# EAGLE design nunchuck_mod (EAGLE 7.7.0)
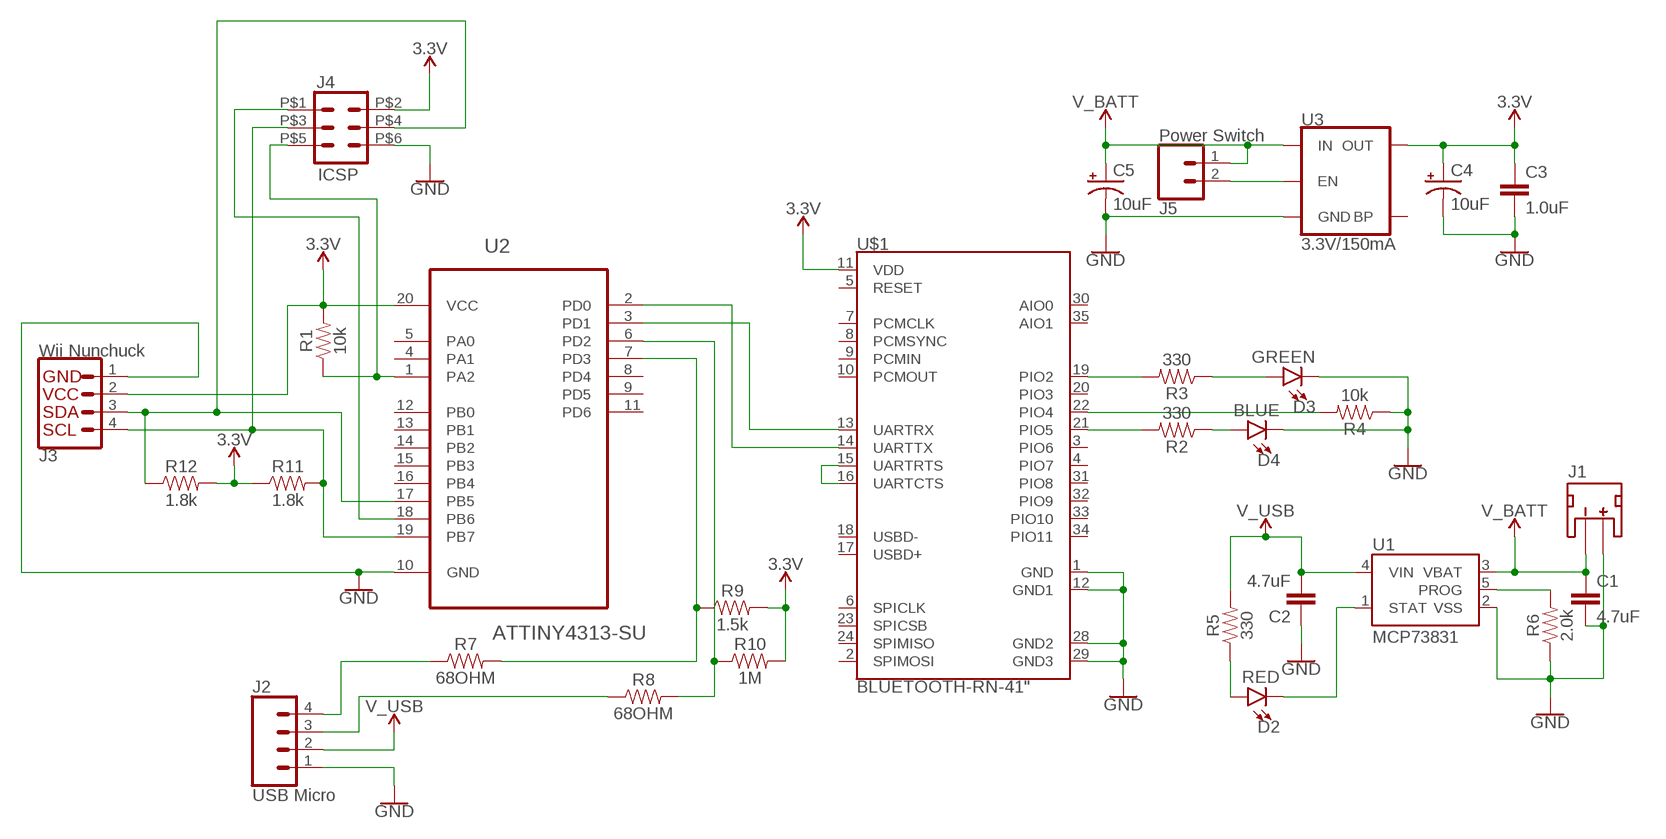
[diagram p0: schematic, sheet 1]

## Parts
C1  4.7uF  4.7UF0603  [0603]
C2  4.7uF  4.7UF0603  [0603]
C3  1.0uF  1.0UF-0603-16V-10%  [0603]
C4  10uF  10UF-POLAR-0603-6.3V-20%(TANT)  [0603-POLAR]
C5  10uF  10UF-POLAR-0603-6.3V-20%(TANT)  [0603-POLAR]
D2  RED  LED-RED0603  [LED-0603]
D3  GREEN  LED-GREEN0603  [LED-0603]
D4  BLUE  LED-BLUE0603  [LED-0603]
J1  JST_2MM_MALE  [JST-2-SMD]
J2  USB Micro  CONN_04  [1X04]
J3  Wii Nunchuck  I2C_STANDARD  [1X04]
J4  ICSP  CONN_03X2POGO_PINS  [2X3_POGO]
J5  Power Switch  CONN_02  [1X02]
R1  10k  10KOHM-0603-1/10W-1%  [0603]
R2  330  330OHM-0603-1/10W-1%  [0603]
R3  330  330OHM-0603-1/10W-1%  [0603]
R4  10k  10KOHM-0603-1/10W-1%  [0603]
R5  330  330OHM-0603-1/10W-1%  [0603]
R6  2.0k  2.0KOHM-0603-1/10W-5%  [0603]
R7  68OHM  68OHM-0603-1/10W-1%  [0603]
R8  68OHM  68OHM-0603-1/10W-1%  [0603]
R9  1.5k  1.5KOHM-0603-1/10W-1%  [0603]
R10  1M  1MOHM-0603-1/4W-5%  [0603]
R11  1.8k  1.8KOHM-0603-1/10W-1%  [0603]
R12  1.8k  1.8KOHM-0603-1/10W-1%  [0603]
U1  MCP73831  [SOT23-5]
U2  ATTINY4313-SU  [SOIC127P1032X265-20N]
U3  3.3V/150mA  V_REG_MIC52053.3V  [SOT23-5]
U$1  BLUETOOTH-RN-41"  [RN41]

## Nets
3.3V: C3.1 C4.+ J3.2 J4.P$2 R1.2 R9.2 R10.2 R11.1 R12.2 U2.20(VCC) U3.5(OUT) U$1.11(VDD)
GND: C1.2 C2.1 C3.2 C4.- C5.- D3.C D4.C J1.2(+) J2.1 J3.1 J4.P$6 R4.1 R6.1 U1.2(VSS) U2.10(GND) U3.2(GND) U$1.1(GND) U$1.12(GND1) U$1.28(GND2) U$1.29(GND3)
N$1: R3.2 U$1.19(PIO2)
N$2: R4.2 U$1.22(PIO4)
N$3: R2.2 U$1.21(PIO5)
N$4: D4.A R2.1
N$5: D3.A R3.1
N$6: U2.2(PD0) U$1.14(UARTTX)
N$7: U2.3(PD1) U$1.13(UARTRX)
N$8: U$1.15(UARTRTS) U$1.16(UARTCTS)
N$10: D2.A R5.1
N$11: R6.2 U1.5(PROG)
N$12: R8.2 R10.1 U2.6(PD2)
N$13: J5.2 U3.3(EN)
N$15: J3.4 J4.P$3 R11.2 U2.19(PB7)
N$16: D2.C U1.1(STAT)
N$18: R7.2 R9.1 U2.7(PD3)
N$19: J2.4 R7.1
N$20: J2.3 R8.1
N$21: J4.P$5 R1.1 U2.1(PA2)
N$22: J3.3 J4.P$4 R12.1 U2.17(PB5)
N$23: J4.P$1 U2.18(PB6)
V_BATT: C1.1 C5.+ J1.1(-) J5.1 U1.3(VBAT) U3.1(IN)
V_USB: C2.2 J2.2 R5.2 U1.4(VIN)
Unconnected: J1.NC1(PAD1) J1.NC2(PAD2) U2.4(PA1) U2.5(PA0) U2.8(PD4) U2.9(PD5) U2.11(PD6) U2.12(PB0) U2.13(PB1) U2.14(PB2) U2.15(PB3) U2.16(PB4) U3.4(BP) U$1.2(SPIMOSI) U$1.3(PIO6) U$1.4(PIO7) U$1.5(RESET) U$1.6(SPICLK) U$1.7(PCMCLK) U$1.8(PCMSYNC) U$1.9(PCMIN) U$1.10(PCMOUT) U$1.17(USBD+) U$1.18(USBD-) U$1.20(PIO3) U$1.23(SPICSB) U$1.24(SPIMISO) U$1.30(AIO0) U$1.31(PIO8) U$1.32(PIO9) U$1.33(PIO10) U$1.34(PIO11) U$1.35(AIO1)

## Library data of the parts
C1 C2 = SparkFun-Capacitors:4.7UF: 4.7µF ceramic capacitors A capacitor is a passive two-terminal electrical component used to store electrical energy temporarily in an electric field.; PROD_ID: CAP-08280
C3 = SparkFun-Capacitors:1.0UF: 1µF ceramic capacitors A capacitor is a passive two-terminal electrical component used to store electrical energy temporarily in an electric field.; PROD_ID: CAP-00868
C4 C5 = SparkFun-Capacitors:10UF-POLAR: 10.0µF polarized capacitors A capacitor is a passive two-terminal electrical component used to store electrical energy temporarily in an electric field.; PROD_ID: CAP-13210
D2 = SparkFun-LED:LED-RED: Red SMD LED Used in manufacturing of most products at SparkFun Packages: 0603 - SMD 0603 package [Product Link] <http://docs.avagotech.com/docs/AV02-0551EN> 0603 SMART - SMD 0603 SMART package ( more efficient and expensive)[Product Link] <http://www.osram-os.com/Graphics/XPic2/00077099_0.pdf> 1206 - SMD1206 package [Product Link] <https://www.sparkfun.com/datasheets/DevTools/LilyPad/Q150OVS4.pdff> SparkFun Products: Pro Mini 328 -5V <https://www.sparkfun.com/products/821> RedBoard <https://www.sparkfun.com/products/12757> IOIO-OTG <https://www.sparkfun.com/products/13613>; PROD_ID: DIO-00819
D3 = SparkFun-LED:LED-GREEN: Green SMD LED Used in manufacturing of various products at SparkFun Packages: 0603 - SMD 0603 package [Product Link] <http://www.futureelectronics.com/en/technologies/semiconductors/optoelectronics/leds/Pages/9894312-LTST-C190GKT.aspx?CrossPart=HSMG-C190&IM=0> LilyPad 1206 - SMD1206 LilyPad package [Product Link] <http://www.futureelectronics.com/en/Technologies/Product.aspx?ProductID=IN150NGHARVATEKCORPORATION2049943&IM=0> 1206 - SMD1206 package [Product Link] <http://www.futureelectronics.com/en/technologies/semiconductors/optoelectronics/leds/Pages/8315665-LTST-C150KGKT.aspx?IM=0> 1206 Bottom Mount -SMD 1206 Bottom Mount [Product Link] <http://www.digikey.com/product-detail/en/lite-on-inc/LTST-C230KGKT/160-1456-1-ND/386854> SparkFun Products: Pro Mini 328 -5V <https://www.sparkfun.com/products/821> RedBoard <https://www.sparkfun.com/products/12757> MP3 Trigger <https://www.sparkfun.com/products/13720> Makey Makey <https://www.sparkfun.com/products/11076>; PROD_ID: DIO-00821
D4 = SparkFun-LED:LED-BLUE: Blue SMD LED Used in manufacturing of various products at SparkFun Packages: 0603 - SMD 0603 package [Product Link] <http://www.digikey.com/product-detail/en/SMLE12BC7TT86/511-1589-2-ND/1641808> 1206 - SMD1206 package [Product Link] <http://www.digikey.com/product-detail/en/lite-on-inc/LTST-C150TBKT/160-1643-1-ND/573584> SparkFun Products: ESP8266 Thing-Dev Board <https://www.sparkfun.com/products/13711> RedBoard <https://www.sparkfun.com/products/12757>; PROD_ID: DIO-08575
J1 = SparkFun-Connectors:JST_2MM_MALE: JST 2MM MALE RA CONNECTOR Two pin, compact surface mount connector. Commonly used as a battery input connection point. We really like the solid locking feeling and high current rating on these small connectors. We use these all the time as battery connectors. Mates to single-cell LiPo batteries. Here is the connector we sell at SparkFun: JST Right Angle Connector - White <https://www.sparkfun.com/products/8612> (PRT-08612) Datasheet <http://www.sparkfun.com/datasheets/Prototyping/Connectors/JST-Horizontal.pdf> It was used on these SparkFun products: SparkFun MOSFET Power Controller <https://www.sparkfun.com/products/11214> (PRT-11214) SparkFun Battery Babysitter - LiPo Battery Manager <https://www.sparkfun.com/products/13777> (PRT-13777) And many, many others that required a lipo battery connection.; PROD_ID: CONN-11443; SF_ID: PRT-08612
J2 = SparkFun-Connectors:CONN_04: Multi connection point. Often used as Generic Header-pin footprint for 0.1 inch spaced/style header connections On any of the 0.1 inch spaced packages, you can populate with these: Break Away Headers - Straight <https://www.sparkfun.com/products/116> (PRT-00116) Break Away Male Headers - Right Angle <https://www.sparkfun.com/products/553> (PRT-00553) Female Headers <https://www.sparkfun.com/products/115> (PRT-00115) Break Away Headers - Machine Pin <https://www.sparkfun.com/products/117> (PRT-00117) Break Away Female Headers - Swiss Machine Pin <https://www.sparkfun.com/products/743> (PRT-00743) For SCREWTERMINALS and SPRING TERMINALS visit here: Screw Terimnals on SparkFun.com <https://www.sparkfun.com/search/results?term=Screw+Terminals> (5mm/3.5mm/2.54mm spacing) This device is also useful as a general connection point to wire up your design to another part of your project. Our various solder wires solder well into these plated through hole pads. Hook-Up Wire - Assortment (Stranded, 22 AWG) <https://www.sparkfun.com/products/11375> (PRT-11375) Hook-Up Wire - Assortment (Solid Core, 22 AWG) <https://www.sparkfun.com/products/11367> (PRT-11367) View the entire wire category on our website here <https://www.sparkfun.com/categories/141> Special notes: Molex polarized connector foot print use with SKU : PRT-08231 with associated crimp pins and housings. 1MM SMD Version SKU: PRT-10208; PROD_ID: CONN-09696
J3 = SparkFun-Connectors:I2C_STANDARD: SparkFun I2C Standard Pinout Header SparkFun has standardized on a pinout for all I2C based sensor breakouts. This pinout allows I2C boards to be plugged directly into the headers on Arduino Uno compatible boards, and to be daisy chained easily. Example SparkFun Products: SparkFun Atmospheric Sensor Breakout - BME280 <https://www.sparkfun.com/products/13676> SparkFun Altitude/Pressure Sensor Breakout - MPL3115A2 <https://www.sparkfun.com/products/11084> SparkFun TOF Range Finder Sensor - VL6180 <https://www.sparkfun.com/products/12785>
J4 = SparkFun-Connectors:CONN_03X2: Multi connection point. Often used as Generic Header-pin footprint for 0.1 inch spaced/style header connections You can populate with any combo of single row headers, but if you'd like an exact match, check these: Header - 2x3 (Male, 0.1") <https://www.sparkfun.com/products/12807> (PRT-12807) Header - 2x3 (Female, 0.1") <https://www.sparkfun.com/products/13010> (PRT-13010) 2x3 Pin Shrouded Header <https://www.sparkfun.com/products/10877> (PRT-10877) On any of the 0.1 inch spaced packages, you can populate with these: Break Away Headers - Straight <https://www.sparkfun.com/products/116> (PRT-00116) Break Away Male Headers - Right Angle <https://www.sparkfun.com/products/553> (PRT-00553) Female Headers <https://www.sparkfun.com/products/115> (PRT-00115) Break Away Headers - Machine Pin <https://www.sparkfun.com/products/117> (PRT-00117) Break Away Female Headers - Swiss Machine Pin <https://www.sparkfun.com/products/743> (PRT-00743) Special note: the shrouded connector mates well with our 3x2 ribbon cables: Ribbon Crimp Connector - 6-pin (2x3, Female) <https://www.sparkfun.com/products/10651> (PRT-10651) Ribbon Cable - 6 wire (15ft) <https://www.sparkfun.com/products/10646> (PRT-10646); PROD_ID: HW-11044
J5 = SparkFun-Connectors:CONN_02: Multi connection point. Often used as Generic Header-pin footprint for 0.1 inch spaced/style header connections On any of the 0.1 inch spaced packages, you can populate with these: Break Away Headers - Straight <https://www.sparkfun.com/products/116> (PRT-00116) Break Away Male Headers - Right Angle <https://www.sparkfun.com/products/553> (PRT-00553) Female Headers <https://www.sparkfun.com/products/115> (PRT-00115) Break Away Headers - Machine Pin <https://www.sparkfun.com/products/117> (PRT-00117) Break Away Female Headers - Swiss Machine Pin <https://www.sparkfun.com/products/743> (PRT-00743) For SCREWTERMINALS and SPRING TERMINALS visit here: Screw Terimnals on SparkFun.com <https://www.sparkfun.com/search/results?term=Screw+Terminals> (5mm/3.5mm/2.54mm spacing) This device is also useful as a general connection point to wire up your design to another part of your project. Our various solder wires solder well into these plated through hole pads. Hook-Up Wire - Assortment (Stranded, 22 AWG) <https://www.sparkfun.com/products/11375> (PRT-11375) Hook-Up Wire - Assortment (Solid Core, 22 AWG) <https://www.sparkfun.com/products/11367> (PRT-11367) View the entire wire category on our website here <https://www.sparkfun.com/categories/141> Special notes: Molex polarized connector foot print use with: PRT-08233 with associated crimp pins and housings. 2.54_SCREWTERM for use with PRT-10571. 3.5mm Screw Terminal footprints for PRT-08084 5mm Screw Terminal footprints for use with PRT-08432
R1 R4 = SparkFun-Resistors:10KOHM: 10kΩ resistor A resistor is a passive two-terminal electrical component that implements electrical resistance as a circuit element. Resistors act to reduce current flow, and, at the same time, act to lower voltage levels within circuits. - Wikipedia; PROD_ID: RES-00824
R2 R3 R5 = SparkFun-Resistors:330OHM: 330Ω resistor A resistor is a passive two-terminal electrical component that implements electrical resistance as a circuit element. Resistors act to reduce current flow, and, at the same time, act to lower voltage levels within circuits. - Wikipedia; PROD_ID: RES-00818
R6 = SparkFun-Resistors:2.0KOHM: 2kΩ resistor A resistor is a passive two-terminal electrical component that implements electrical resistance as a circuit element. Resistors act to reduce current flow, and, at the same time, act to lower voltage levels within circuits. - Wikipedia; PROD_ID: RES-08296
R7 R8 = SparkFun-Resistors:68OHM: 68Ω resistor A resistor is a passive two-terminal electrical component that implements electrical resistance as a circuit element. Resistors act to reduce current flow, and, at the same time, act to lower voltage levels within circuits. - Wikipedia
R9 = SparkFun-Resistors:1.5KOHM: 1.5kΩ resistor A resistor is a passive two-terminal electrical component that implements electrical resistance as a circuit element. Resistors act to reduce current flow, and, at the same time, act to lower voltage levels within circuits. - Wikipedia; PROD_ID: RES-08306
R10 = SparkFun-Resistors:1MOHM: 1MΩ resistor A resistor is a passive two-terminal electrical component that implements electrical resistance as a circuit element. Resistors act to reduce current flow, and, at the same time, act to lower voltage levels within circuits. - Wikipedia; PROD_ID: RES-07868
R11 R12 = SparkFun-Resistors:1.8KOHM: 1.8kΩ resistor A resistor is a passive two-terminal electrical component that implements electrical resistance as a circuit element. Resistors act to reduce current flow, and, at the same time, act to lower voltage levels within circuits. - Wikipedia; PROD_ID: RES-09119
U1 = SparkFun-IC-Power:MCP73831: MCP73831T Li-Ion, Li-Pol Controller Miniature single cell, fully integrated Li-Ion, Li-polymer charge management controller Datasheet <http://ww1.microchip.com/downloads/en/DeviceDoc/20001984g.pdf> SparkFun Products: SparkFun ESP32 Thing <https://www.sparkfun.com/products/13907> SparkFun 9DoF Razor IMU M0 <https://www.sparkfun.com/products/14001>; PROD_ID: IC-09995
U2 = Atmel_By_element14_Batch_1-00:ATTINY4313-SU: 8-bit Microcontroller with In-System Programmable Flash; MPN: ATTINY4313-SU; OC_FARNELL: 1841621; OC_NEWARK: 12T1340; PACKAGE: SOIC-20; SUPPLIER: Atmel
U3 = SparkFun-IC-Power:V_REG_MIC5205: V_REG MIC5205 Standard 3.3V, 5V, and Adjustable 150mA LDO voltage regulator in SOT-23 layout. Micrel part MIC5205. BP (by-pass) pin is used to lower output noise with 470pF cap, may be left open. On the adjustable version BP is used to set output.; PROD_ID: VREG-00822
U$1 = SparkFun-RF:BLUETOOTH-RN-41: Roving Networks RN-41 Bluetooth Module The RN-41 module is a small form factor, low power, class 1 Bluetooth radio that is ideal for designers who want to add wireless capability to their products without spending significant time and money developing Bluetooth-specific hardware and software. The RN-41 supports multiple interface protocols, is simple to design in, and is fully certified, making it a complete embedded Bluetooth solution. SparkFun Products: Bluetooth SMD Module - RN-41 <https://www.sparkfun.com/products/12575> (WRL-12575) Bluetooth Module Breakout - Roving Networks (RN-41 v6.15) <https://www.sparkfun.com/products/12579> (WRL-12579); PROD_ID: IC-11844; SF_ID: WRL-12575

## Board
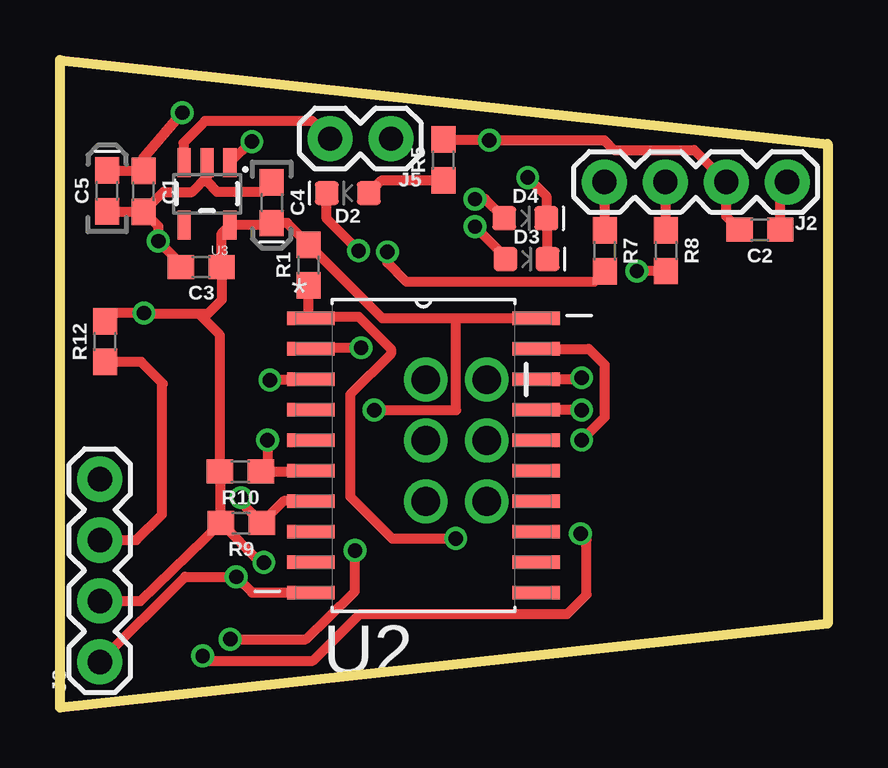
[diagram p1: board, top side]
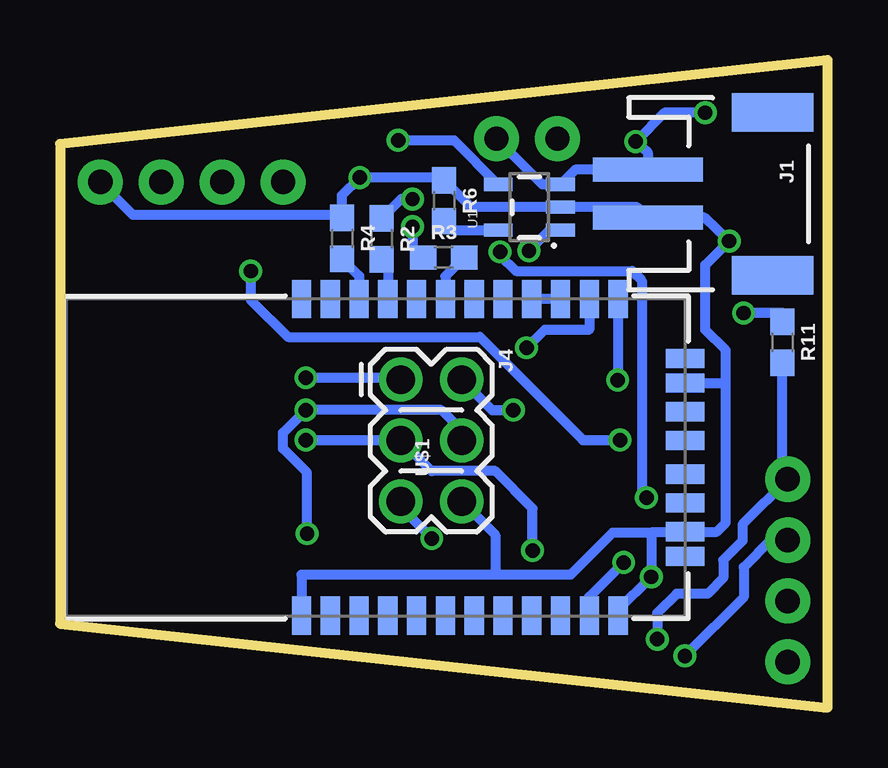
[diagram p2: board, bottom side, seen from below]

Size 32 x 27 mm. Coordinates in mm from the lower left corner, seen from the top.
Outline: 0,0 0,27 32,23.5 32,3.5 0,0
Copper layers (1*16): Top 0.0356mm / dielectric 1.5011mm / Bottom 0.0356mm
Design rules "OshPark": minimum track width 6mil, minimum drill 13mil, track to track 6mil, track to pad 6mil, pad to pad 6mil, via to via 6mil, smd to smd 6mil, copper to edge 15mil, drill to drill 6mil, minimum pad ring 7mil, minimum via ring 7mil, stop-mask expansion 3mil, vias tented up to drill 0mil, thermal gap 10mil

### Footprints (pad centres in the part's own frame; a part is rotated, then mirrored left to right if it is on the bottom)
0603 = smd 1.1 x 1: 1 -0.85,0; 2 0.85,0
0603-POLAR = smd 1.1 x 1: + 0.85,0; - -0.85,0
LED-0603 = smd 1 x 1: A -0.877,0; C 0.877,0
JST-2-SMD = smd 1 x 4.6: 1 -1,-3.7; 2 1,-3.7 | smd 1.6 x 3.4: NC1 -3.4,1.5; NC2 3.4,1.5
1X04 = drill 1.016 pad 1.88: 1 0,0; 2 2.54,0; 3 5.08,0; 4 7.62,0
2X3_POGO = drill 1.2 pad 1.829: P$1 0,0; P$2 0,2.54; P$3 2.54,0; P$4 2.54,2.54; P$5 5.08,0; P$6 5.08,2.54
1X02 = drill 1.016 pad 1.88: 1 0,0; 2 2.54,0
SOT23-5 = smd 0.55 x 1.2: 1 -0.95,-1.3; 2 0,-1.3; 3 0.95,-1.3; 4 0.95,1.3; 5 -0.95,1.3
SOIC127P1032X265-20N = smd 1.981 x 0.559: 1 -4.699,5.715; 2 -4.699,4.445; 3 -4.699,3.175; 4 -4.699,1.905; 5 -4.699,0.635; 6 -4.699,-0.635; 7 -4.699,-1.905; 8 -4.699,-3.175; 9 -4.699,-4.445; 10 -4.699,-5.715; 11 4.699,-5.715; 12 4.699,-4.445; 13 4.699,-3.175; 14 4.699,-1.905; 15 4.699,-0.635; 16 4.699,0.635; 17 4.699,1.905; 18 4.699,3.175; 19 4.699,4.445; 20 4.699,5.715
RN41 = smd 0.8 x 1.6: 1 -6.6,-6.6; 2 -5.4,-6.6; 3 -4.2,-6.6; 4 -3,-6.6; 5 -1.8,-6.6; 6 -0.6,-6.6; 7 0.6,-6.6; 8 1.8,-6.6; 9 3,-6.6; 10 4.2,-6.6; 11 5.4,-6.6; 12 6.6,-6.6; 13 6.6,6.6; 14 5.4,6.6; 15 4.2,6.6; 16 3,6.6; 17 1.8,6.6; 18 0.6,6.6; 19 -0.6,6.6; 20 -1.8,6.6; 21 -3,6.6; 22 -4.2,6.6; 23 -5.4,6.6; 24 -6.6,6.6 | smd 1.6 x 0.8: 28 9.4,3.1; 29 9.4,-3.1; 30 9.4,4.122; 31 9.4,1.9; 32 9.4,0.7; 33 9.4,-0.7; 34 9.4,-1.9; 35 9.4,-4.122

### Placement (x,y rotation side)
C1  3.48,21.52 270 top
C2  29.18,19.92 180 top
C3  5.89,18.37 180 top
C4  8.83,21.05 270 top
C5  1.97,21.54 90 top
D2  12,21.45 180 top
D3  19.45,18.7 0 top
D4  19.4,20.4 0 top
J1  3.79,21.42 270 bottom
J2  30.32,21.91 180 top
J3  1.66,1.9 90 top
J4  17.79,13.67 270 bottom
J5  13.8,23.72 180 top
R1  10.37,18.45 90 top
R2  18.59,19.54 270 bottom
R3  16,18.76 0 bottom
R4  20.24,19.56 270 bottom
R5  15.99,22.83 90 top
R6  15.99,21.13 270 bottom
R7  22.71,19.04 270 top
R8  25.26,19.05 270 top
R9  7.56,7.69 180 top
R10  7.52,9.84 180 top
R11  1.89,15.23 270 bottom
R12  1.88,15.26 90 top
U1  12.43,20.86 90 bottom
U2  15.15,10.51 0 top
U3  6.13,21.42 180 top
U$1  15.33,10.43 0 bottom

### Tracks (layer width: path | path; a pad name or v marks a point on that pad's centre or on a via)
3.3V  (via drill 0.6)
  Top 0.406: v8.5,6.05 8.35,6.05 R9.2 | U2.20 16.52,16.23 | 16.52,16.23 13.45,16.23 R1.2 9.47,20.2 C4.+ 8.75,20.12 U3.5 6.74,19.78 C3.1 6.74,16.99 6.15,16.4 5.8,16.4 | J3.2 3.36,4.44 R9.2 | R12.2 2.22,16.45 v3.5,16.45 3.55,16.4 5.8,16.4 | R9.2 6.67,7.73 R10.2 6.67,15.53 5.8,16.4 | v13.1,12.4 16.52,12.4 16.52,16.23
  Bottom 0.406: U$1.11 9.93,4.62 v8.5,6.05 | R11.1 1.89,16.45 v3.5,16.45 | J4.P$2 13.98,12.4 v13.1,12.4
GND  (via drill 0.6)
  Top 0.406: C1.2 3.48,20.69 4.1,20.07 v4.1,19.45 5.04,18.51 C3.2 | C1.2 4.31,21.5 5.5,21.5 6.13,22.13 | 6.13,22.13 U3.2 | C5.- 1.99,20.67 C1.2 | C4.- 8.43,21.5 6.55,21.5 6.13,21.92 6.13,22.13 | D3.C 20.33,20.35 D4.C 20.28,21.32 v19.5,22.1 | C2.1 30.03,21.62 J2.1 | U2.10 8.01,4.79 v7.35,5.45 5.21,5.45 J3.1
  Bottom 0.406: v4.1,19.45 5.12,20.42 J1.2 7.93,20.86 U1.2 14.87,20.86 R6.1 16.11,22.1 v19.5,22.1 20.24,21.36 R4.1 20.38,20.55 28.96,20.55 J2.1 | U$1.12 8.73,4.07 v7.35,5.45 7.35,7.3 | 7.35,7.3 5.96,7.3 U$1.29 4.62,7.33 4.25,7.7 4.25,13.6 | 13.85,5.55 21.93,5.55 U$1.1 | 13.85,5.55 10.7,5.55 8.95,7.3 7.35,7.3 | 4.25,19.3 v4.1,19.45 | 4.25,13.6 4.25,14.9 5.1,15.75 5.1,18.45 v4.1,19.45 | U$1.28 4.32,13.53 4.25,13.6 | J4.P$6 13.85,7.19 13.85,5.55
N$1
  Bottom 0.406: R3.2 15.93,17.98 U$1.19
N$2
  Bottom 0.406: R4.2 19.53,18 U$1.22
N$3
  Bottom 0.406: R2.2 18.33,18.43 U$1.21
N$4  (via drill 0.6)
  Top 0.406: D4.A 17.72,21.2 v17.3,21.2
  Bottom 0.406: v17.3,21.2 17.78,21.2 R2.1
N$5  (via drill 0.6)
  Top 0.406: D3.A 18.57,18.78 v17.3,20.05
  Bottom 0.406: v17.3,20.05 17.3,19.21 R3.1
N$6  (via drill 0.6)
  Top 0.406: v12.55,15 10.5,15 U2.2
  Bottom 0.406: U$1.14 9.93,15.77 9.95,15.75 11.8,15.75 v12.55,15
N$7  (via drill 0.6)
  Top 0.406: v8.75,13.65 8.79,13.69 U2.3
  Bottom 0.406: U$1.13 8.75,17.01 v8.75,13.65
N$8
  Bottom 0.406: U$1.15 U$1.16
N$10
  Top 0.406: D2.A 13.41,21.98 R5.1
N$11
  Bottom 0.406: R6.2 15.62,19.91 U1.5
N$12  (via drill 0.6)
  Top 0.406: U2.6 10.42,9.84 R10.1 8.65,10.12 v8.65,11.15 | R8.2 v24.05,18.2
  Bottom 0.406: v8.65,11.15 10.2,11.15 14.5,15.45 22.5,15.45 24.05,17 v24.05,18.2
N$13
  Top 0.406: J5.2 10.53,24.45 6.05,24.45 5.15,23.55 5.15,22.75 U3.3
N$15  (via drill 0.6)
  Top 0.406: v7.1,2.85 10.25,2.85 12.2,4.75 12.3,4.85 v12.3,6.55 | 19.8,15 U2.19 22.05,14.96 22.7,14.3 22.7,12.1 v21.75,11.15
  Bottom 0.406: R11.2 1.89,9.75 J3.4 3.55,7.63 3.55,6.95 4.35,6.15 4.35,5.4 5,4.75 6.29,4.75 7.1,3.94 v7.1,2.85 | v12.3,6.55 12.3,8.3 13.85,9.86 16.51,9.86 J4.P$3 17.81,11.15 v21.75,11.15
N$16  (via drill 0.6)
  Top 0.406: v12.45,19.05 11.12,20.38 D2.C
  Bottom 0.406: U1.1 11.59,19.91 v12.45,19.05
N$18  (via drill 0.6)
  Top 0.406: U2.7 9.32,8.61 R9.1 7.55,8.55 v7.55,8.75 | R7.2 22.27,17.75 14.45,17.75 13.65,18.55 v13.65,19
  Bottom 0.406: v13.65,19 13.65,18.85 13,18.2 8.15,18.2 7.75,17.8 7.75,8.95 v7.55,8.75
N$19
  Top 0.406: R7.1 J2.4
N$20
  Top 0.406: R8.1 25.26,21.89 J2.3
N$21  (via drill 0.6)
  Top 0.406: R1.1 10.37,16.31 U2.1 10.53,16.3 12.45,16.3 13.8,14.95 13.8,14.75 12.1,13.05 12.1,8.8 13.85,7.05 v16.5,7.05
  Bottom 0.406: v16.5,7.05 17.79,8.34 J4.P$5
N$22  (via drill 0.6)
  Top 0.406: v5.95,2.15 6.15,1.95 10.55,1.95 12.5,3.9 21.15,3.9 21.95,4.7 21.95,7 v21.7,7.25 | 19.83,12.4 U2.17 19.86,12.4 v21.75,12.4 | J3.3 3.18,6.98 4.25,8.05 4.25,13.45 4.3,13.5 3.39,14.41 R12.1
  Bottom 0.406: J3.3 2.37,6.98 3.5,5.85 3.5,4.6 v5.95,2.15 | J4.P$4 15.25,11.55 16.1,12.4 v21.75,12.4 22.7,11.45 22.7,10.8 21.7,9.8 v21.7,7.25
N$23  (via drill 0.6)
  Top 0.406: v21.75,13.75 21.68,13.69 U2.18
  Bottom 0.406: J4.P$1 17.87,13.75 v21.75,13.75
V_BATT  (via drill 0.6)
  Top 0.406: C5.+ 3.48,22.39 C1.1 3.48,22.93 v5.1,24.8 | U3.1 8,23.64 v8,23.6
  Bottom 0.406: J5.1 11.89,21.81 U1.3 10.52,22.42 J1.1 7.49,23.14 v8,23.6 6.8,24.8 v5.1,24.8
V_USB  (via drill 0.6)
  Top 0.406: C2.2 27.78,20.47 J2.2 26.44,23.25 23.1,23.25 22.7,23.65 v17.9,23.65 17.87,23.68 R5.2
  Bottom 0.406: v17.9,23.65 15.57,23.65 U1.4